# Altium schematic sheet BUZZER.SchDoc
size A4; Author: Khanh BK; Organization: DB Bach Khoa HN; Address1: Bach Khoa- HBT - HN; Address2: khanh.db192932; Address3: Youtube: Đào Bá Khánh; Address4: 0357698570; Revision: 1.0Ver; SheetNumber: 5; SheetTotal: 9
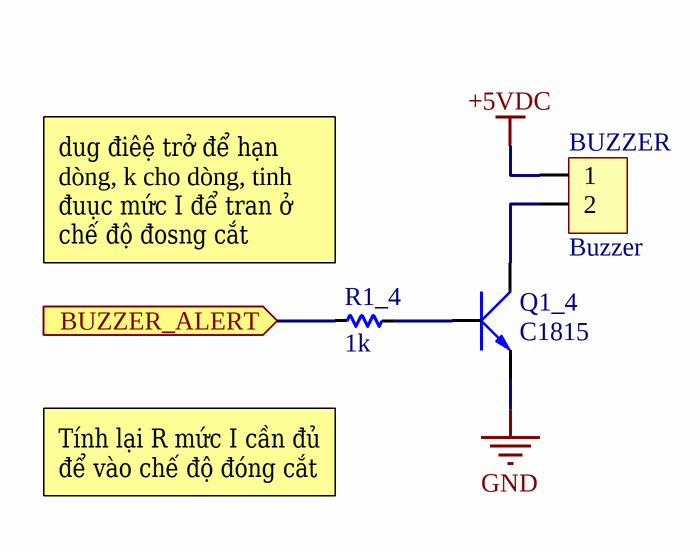
[diagram p0: BUZZER.SchDoc]

## Parts
BUZZER  Buzzer  [Header2]
Q1_4  C1815  [SOT23-321]
R1_4  1k  [RES-SMD-0805]

## Ports
BUZZER_ALERT (in)

## Nets
+5VDC: BUZZER.1
GND: Q1_4.1(E)
BUZZER_ALERT: R1_4.2 ; port BUZZER_ALERT
NetBUZZER_2: BUZZER.2 Q1_4.2(C)
NetQ1_4_3: Q1_4.3(B) R1_4.1

## Notes on the sheet
- (near R1_4) dug điêệ trở để hạn dòng, k cho dòng, tinh đuục mức I để tran ở chế độ đosng cắt
- (near R1_4) Tính lại R mức I cần đủ để vào chế độ đóng cắt
- Title
- Size:
- Date:
- Author:
- A4
- Time:
- Number:
- Checked:
- Revision:
- Sheet
- Approved:
- of
- File:

## Library data of the parts
BUZZER = Header2: Header IDC, 2 x 1 Pin Vertical 2.54mm Pitch (Non-Boxed, Male); Manufacturer: W¨¹rth Elektronik eiSos GmbH; partNo: 613002143121; ComponentLink1 Description: Manufacturer; ComponentLink2 Description: Datasheet; NoPins: 02; Created Date: 29 March 2013; ComponentLink1URL: http://www.we-online.com; ComponentLink2URL: http://katalog.we-online.de/em/datasheet/6130xx143121.pdf; Created by: Karrer Zheng
Q1_4 = 2SC1815: NPN 600mW, ECB; Value: C1815
R1_4 = Res-SMD: Resistor; Manufacturer: Generic Components; Class: Passive; Published: 08/06/2000; Publisher: Altium Hobart Technology Centre